# Altium schematic sheet 1_cover.SchDoc: Cover and block diagram
size A4; ENG_APP_DATE: --/--/--; DSN_APP_DATE: --/--/--; CHK_APP_DATE: --/--/--; OrganizationName: Pluton UPV; Address1: Universitat Politècnica; Address2: de València (UPV); Address3: Camí de Vera, València; Address4: Spain; DocumentNumber: 1; Revision: 0; SheetNumber: 1; SheetTotal: 8
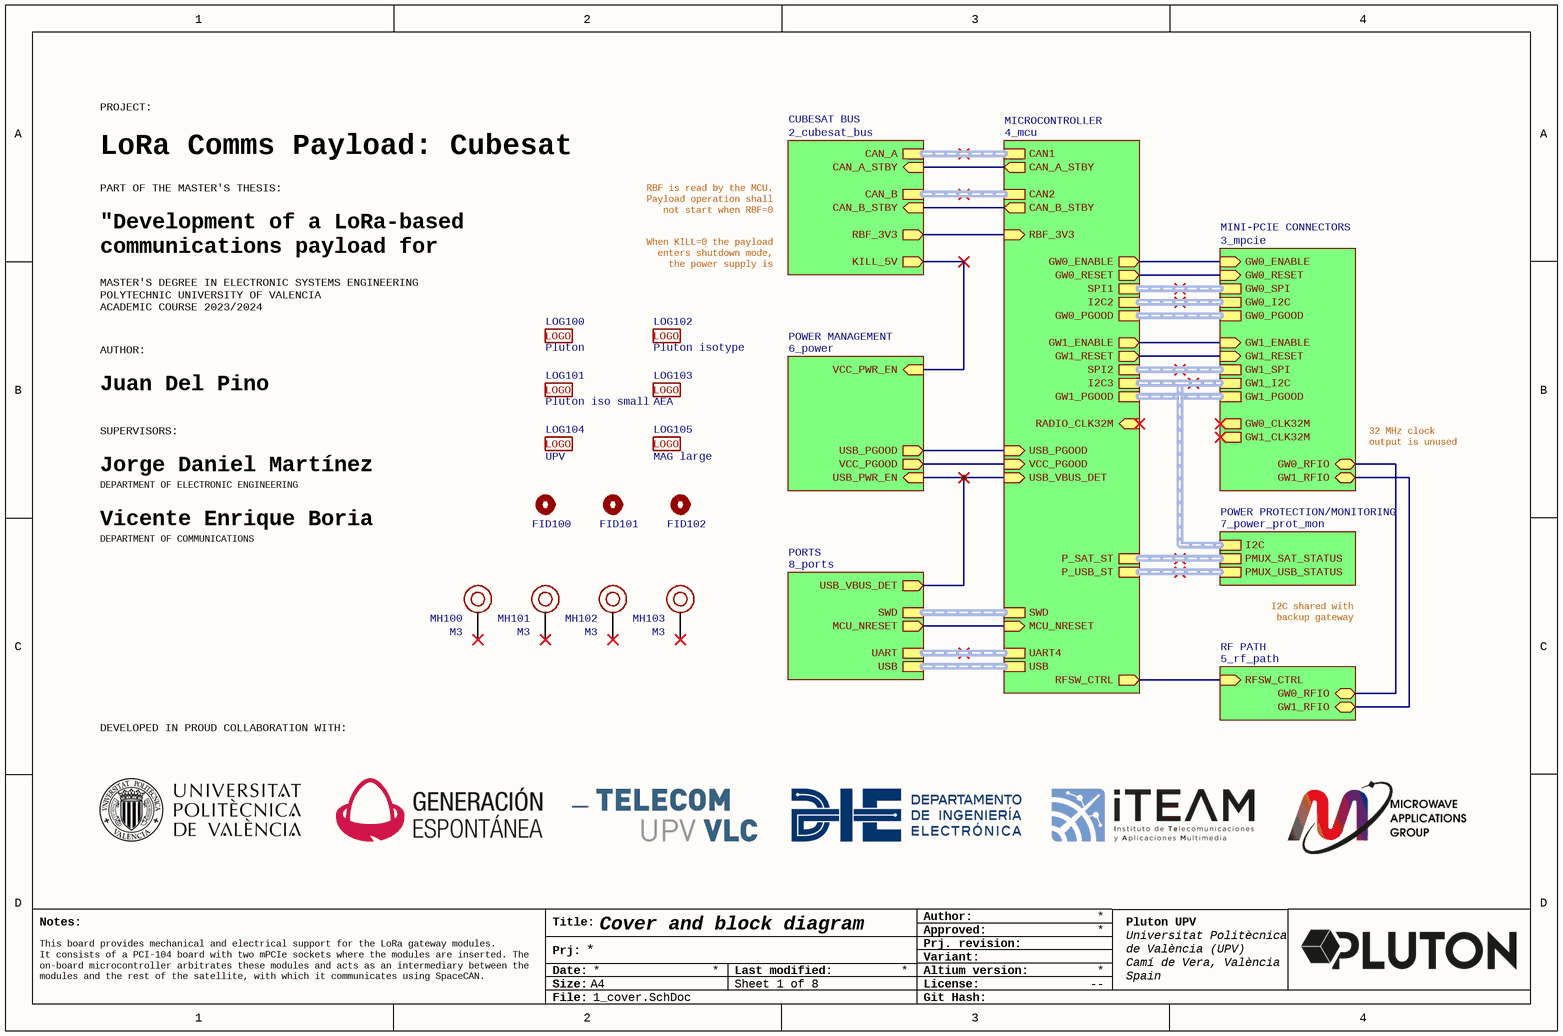
[diagram p0: 1_cover.SchDoc]

## Parts
FID100  Fiducial Mark  [Fiducial_1_3_mm]  (value not drawn)  (no BOM)
FID101  Fiducial Mark  [Fiducial_1_3_mm]  (value not drawn)  (no BOM)
FID102  Fiducial Mark  [Fiducial_1_3_mm]  (value not drawn)  (no BOM)
LOG100  Pluton  [logo_pluton]  (no BOM)
LOG101  Pluton iso small  [logo_pluton_isotype_small]  (no BOM)
LOG102  Pluton isotype  [logo_pluton_isotype]  (no BOM)
LOG103  AEA  [logo_aea]  (no BOM)
LOG104  UPV  [logo_upv]  (no BOM)
LOG105  MAG large  [logo_mag_big]  (no BOM)
MH100  M3  [MH Cubesat M3]  (no BOM)
MH101  M3  [MH Cubesat M3]  (no BOM)
MH102  M3  [MH Cubesat M3]  (no BOM)
MH103  M3  [MH Cubesat M3]  (no BOM)

## Sub-sheets
CUBESAT BUS = 2_cubesat_bus: CAN_A (harness CAN), CAN_B (harness CAN), CAN_A_STBY (in), CAN_B_STBY (in), KILL_5V (out), RBF_3V3 (out)
MICROCONTROLLER = 4_mcu: SWD (harness SWD), USB (harness USB), RADIO_CLK32M (in), MCU_NRESET (in), GW1_RESET (out), GW0_RESET (out), GW0_ENABLE (out), GW1_ENABLE (out), GW0_PGOOD (harness PGOOD), GW1_PGOOD (harness PGOOD), RBF_3V3 (in), VCC_PGOOD (in), SPI1 (harness SPI), SPI2 (harness SPI), CAN1 (harness CAN), CAN2 (harness CAN), I2C3 (harness I2C), I2C2 (harness I2C), UART4 (harness UART), CAN_B_STBY (out), CAN_A_STBY (out), RFSW_CTRL (out), USB_PGOOD (in), USB_VBUS_DET (in), P_SAT_ST (harness PMUX_STATUS), P_USB_ST (harness PMUX_STATUS)
MINI-PCIE CONNECTORS = 3_mpcie: GW0_RESET (in), GW0_ENABLE (in), GW0_CLK32M (out), GW1_RESET (in), GW1_ENABLE (in), GW1_CLK32M (out), GW0_SPI (harness SPI), GW0_PGOOD (harness PGOOD), GW1_SPI (harness SPI), GW0_I2C (harness I2C), GW1_PGOOD (harness PGOOD), GW1_I2C (harness I2C), GW0_RFIO (bidir), GW1_RFIO (bidir)
PORTS = 8_ports: SWD (harness SWD), MCU_NRESET (out), UART (harness UART), USB (harness USB), USB_VBUS_DET (out)
POWER MANAGEMENT = 6_power: VCC_PWR_EN (in), VCC_PGOOD (out), USB_PGOOD (out), USB_PWR_EN (in)
POWER PROTECTION/MONITORING = 7_power_prot_mon: I2C (harness I2C), PMUX_SAT_STATUS (harness PMUX_STATUS), PMUX_USB_STATUS (harness PMUX_STATUS)
RF PATH = 5_rf_path: RFSW_CTRL (in), GW0_RFIO (bidir), GW1_RFIO (bidir)

## Nets
(unnamed): sheet CUBESAT BUS/CAN_A_STBY, sheet MICROCONTROLLER/CAN_A_STBY
(unnamed): sheet CUBESAT BUS/CAN_B_STBY, sheet MICROCONTROLLER/CAN_B_STBY
(unnamed): sheet CUBESAT BUS/KILL_5V, sheet POWER MANAGEMENT/VCC_PWR_EN
(unnamed): sheet CUBESAT BUS/RBF_3V3, sheet MICROCONTROLLER/RBF_3V3
(unnamed): sheet RF PATH/RFSW_CTRL, sheet MICROCONTROLLER/RFSW_CTRL
(unnamed): sheet RF PATH/GW0_RFIO, sheet MINI-PCIE CONNECTORS/GW0_RFIO
(unnamed): sheet RF PATH/GW1_RFIO, sheet MINI-PCIE CONNECTORS/GW1_RFIO
(unnamed): sheet MINI-PCIE CONNECTORS/GW0_RESET, sheet MICROCONTROLLER/GW0_RESET
(unnamed): sheet MINI-PCIE CONNECTORS/GW0_ENABLE, sheet MICROCONTROLLER/GW0_ENABLE
(unnamed): sheet MINI-PCIE CONNECTORS/GW1_RESET, sheet MICROCONTROLLER/GW1_RESET
(unnamed): sheet MINI-PCIE CONNECTORS/GW1_ENABLE, sheet MICROCONTROLLER/GW1_ENABLE
(unnamed): sheet POWER MANAGEMENT/VCC_PGOOD, sheet MICROCONTROLLER/VCC_PGOOD
(unnamed): sheet POWER MANAGEMENT/USB_PGOOD, sheet MICROCONTROLLER/USB_PGOOD
(unnamed): sheet POWER MANAGEMENT/USB_PWR_EN, sheet MICROCONTROLLER/USB_VBUS_DET, sheet PORTS/USB_VBUS_DET
(unnamed): sheet MICROCONTROLLER/MCU_NRESET, sheet PORTS/MCU_NRESET

Not connected (* = marked no-connect by the designer): MH100 1*; MH101 1*; MH102 1*; MH103 1*

## Buses and harness runs
harness sheet CUBESAT BUS/CAN_A = sheet MICROCONTROLLER/CAN1
harness sheet CUBESAT BUS/CAN_B = sheet MICROCONTROLLER/CAN2
harness sheet MICROCONTROLLER/GW0_PGOOD = sheet MINI-PCIE CONNECTORS/GW0_PGOOD
harness sheet MICROCONTROLLER/GW1_PGOOD = sheet MINI-PCIE CONNECTORS/GW1_PGOOD
harness sheet MICROCONTROLLER/I2C2 = sheet MINI-PCIE CONNECTORS/GW0_I2C
harness sheet MICROCONTROLLER/I2C3 = sheet MINI-PCIE CONNECTORS/GW1_I2C = sheet POWER PROTECTION/MONITORING/I2C
harness sheet MICROCONTROLLER/P_SAT_ST = sheet POWER PROTECTION/MONITORING/PMUX_SAT_STATUS
harness sheet MICROCONTROLLER/P_USB_ST = sheet POWER PROTECTION/MONITORING/PMUX_USB_STATUS
harness sheet MICROCONTROLLER/SPI1 = sheet MINI-PCIE CONNECTORS/GW0_SPI
harness sheet MICROCONTROLLER/SPI2 = sheet MINI-PCIE CONNECTORS/GW1_SPI
harness sheet MICROCONTROLLER/SWD = sheet PORTS/SWD
harness sheet MICROCONTROLLER/UART4 = sheet PORTS/UART
harness sheet MICROCONTROLLER/USB = sheet PORTS/USB

## Notes on the sheet
- PROJECT:
- LoRa Comms Payload: Cubesat Carrier
- PART OF THE MASTER'S THESIS:
- RBF is read by the MCU. Payload operation shall not start when RBF=0
- (near LOG100) MASTER'S DEGREE IN ELECTRONIC SYSTEMS ENGINEERING
  POLYTECHNIC UNIVERSITY OF VALENCIA
  ACADEMIC COURSE 2023/2024
- "Development of a LoRa-based communications payload for CubeSat"
- When KILL=0 the payload enters shutdown mode, the power supply is disabled.
- AUTHOR:
- Juan Del Pino Mena
- SUPERVISORS:
- 32 MHz clock output is unused
- Jorge Daniel Martínez Pérez
- Vicente Boria Esbert
- DEPARTMENT OF ELECTRONIC ENGINEERING
- Vicente Enrique Boria Esbert
- DEPARTMENT OF COMMUNICATIONS
- I2C shared with backup gateway
- DEVELOPED IN PROUD COLLABORATION WITH:
- This board provides mechanical and electrical support for the LoRa gateway modules.
  It consists of a PCI-104 board with two mPCIe sockets where the modules are inserted. The on-board microcontroller arbitrates these modules and acts as an intermediary between the modules and the rest of the satellite, with which it communicates using SpaceCAN.
- Notes:
- Title:
- Author:
- Approved:
- Date:
- Prj:
- Size:
- A4
- Last modified:
- Altium version:
- Variant:
- Prj. revision:
- License:
- --
- File:
- Git Hash:
- (in symbol Logo) LOGO

## Library data of the parts
FID100-FID102 = Fiducial Mark: FIducial Mark (concentric 1 mm, 3 mm)
LOG100-LOG105 = Logo
MH100-MH103 = MH M3